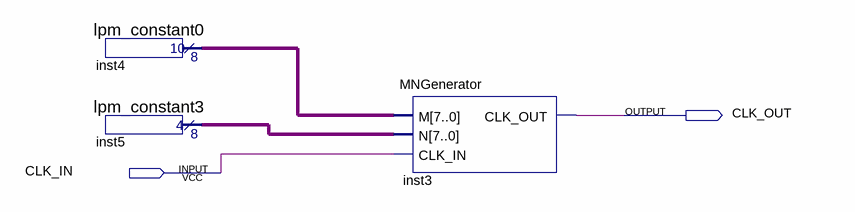
[diagram p0: schematic sheet]
// Quartus schematic FrequencyDivider.bdf as structural Verilog: 3 symbols, 2 pins
module FrequencyDivider (
  input  CLK_IN,
  output CLK_OUT
);

  wire [7:0] inst4_result, inst5_result;

  lpm_constant0 inst4 (.result(inst4_result));
  lpm_constant3 inst5 (.result(inst5_result));
  MNGenerator inst3 (.M(inst4_result), .N(inst5_result), .CLK_IN(CLK_IN), .CLK_OUT(CLK_OUT));
endmodule
